# EAGLE design basic (EAGLE 8.3.2)
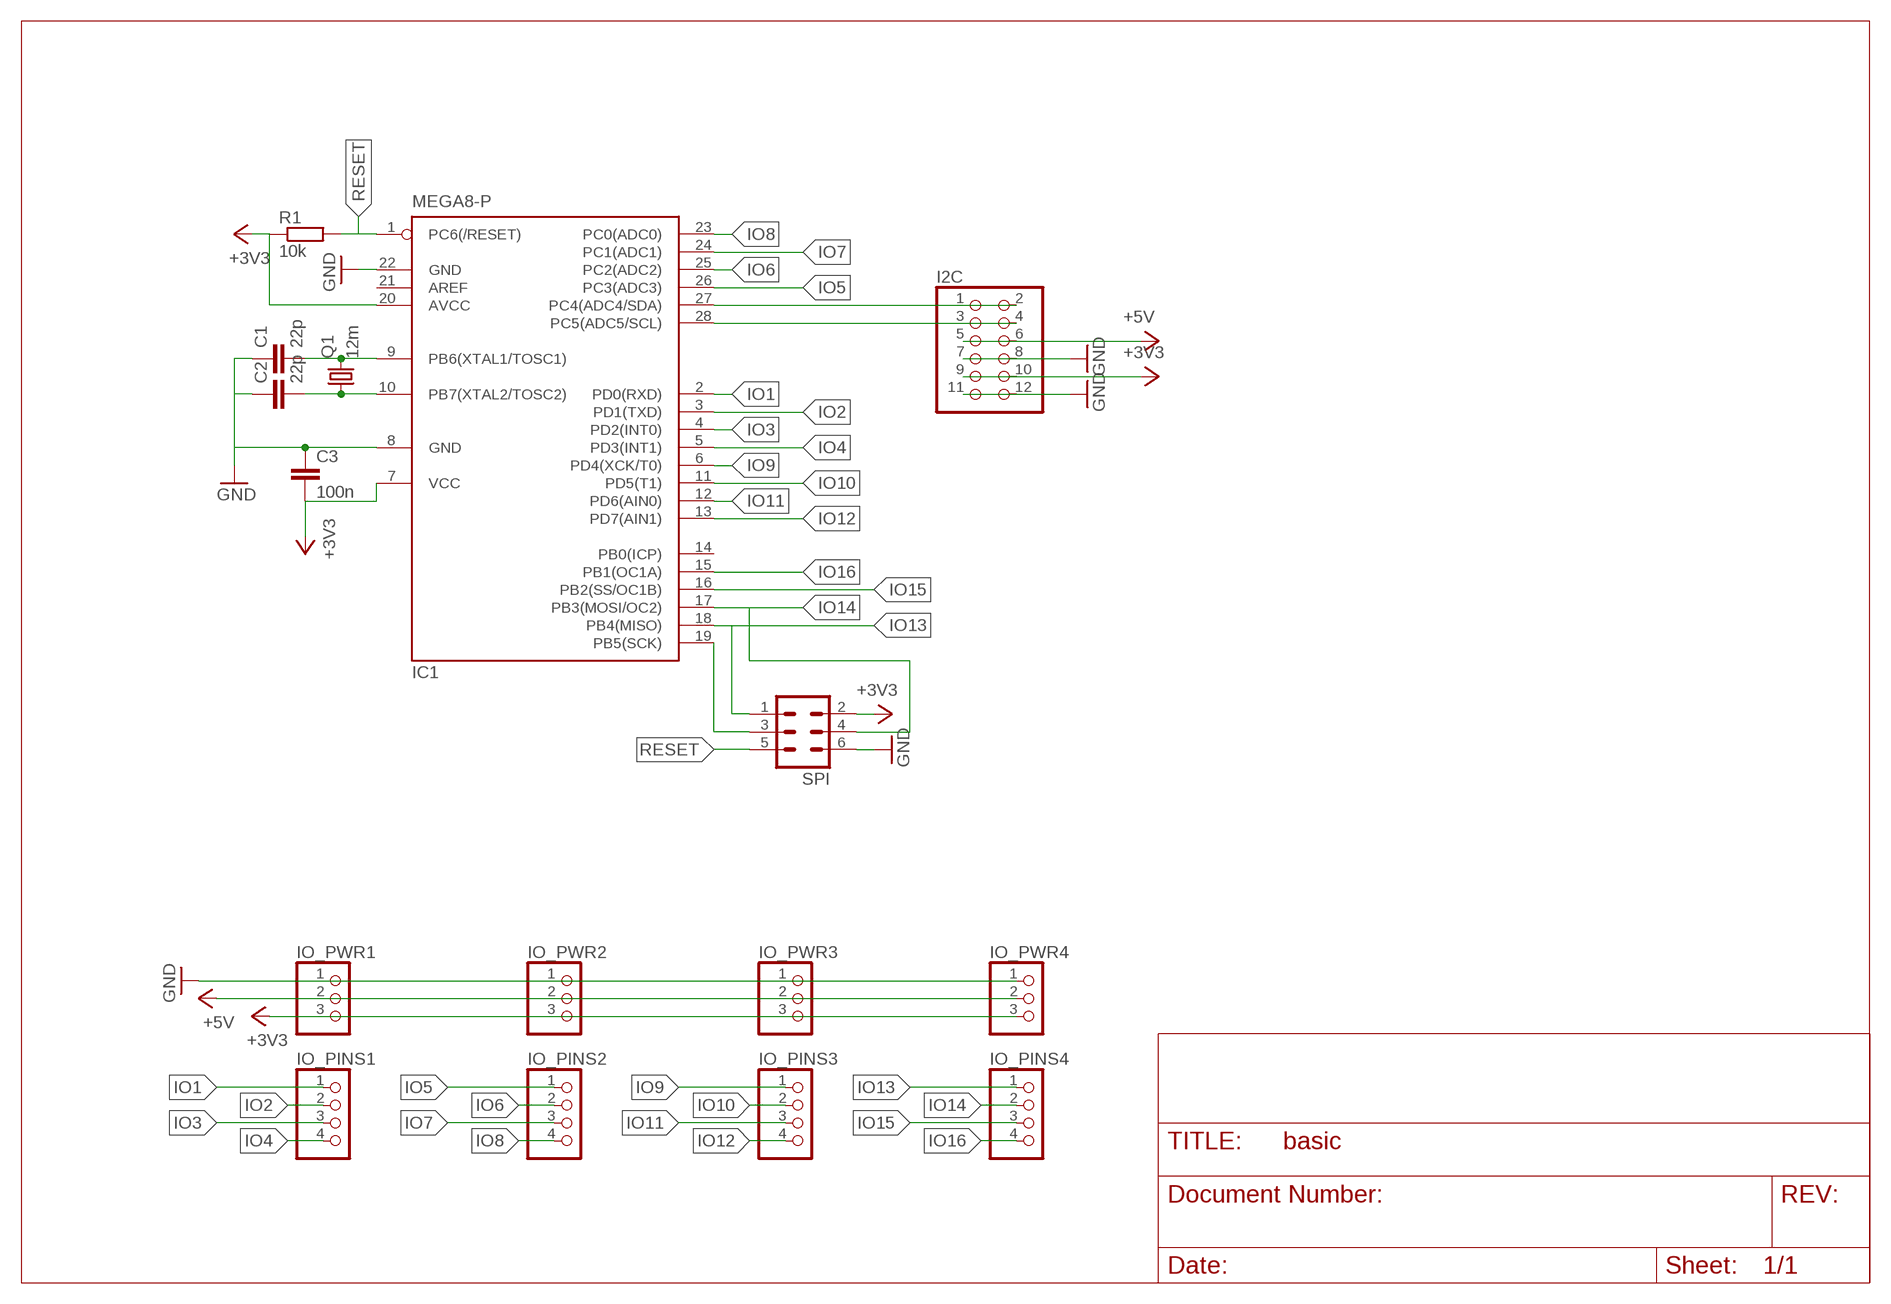
[diagram p0: schematic, sheet 1]

## Parts
C1  22p  C-EU025-025X050  [C025-025X050]
C2  22p  C-EU025-025X050  [C025-025X050]
C3  100n  C-EU025-025X050  [C025-025X050]
I2C  PINHD-2X6  [2X06]
IC1  MEGA8-P  [DIL28-3]
IO_PINS1  PINHD-1X4  [1X04]
IO_PINS2  PINHD-1X4  [1X04]
IO_PINS3  PINHD-1X4  [1X04]
IO_PINS4  PINHD-1X4  [1X04]
IO_PWR1  PINHD-1X3  [1X03]
IO_PWR2  PINHD-1X3  [1X03]
IO_PWR3  PINHD-1X3  [1X03]
IO_PWR4  PINHD-1X3  [1X03]
Q1  12m  CRYSTALHC49S  [HC49/S]
R1  10k  R-EU_0207/10  [0207/10]
SPI  ML6  [ML6]

## Nets
+3V3: C3.2 I2C.9 I2C.10 IC1.7(VCC) IC1.20(AVCC) IO_PWR1.3 IO_PWR2.3 IO_PWR3.3 IO_PWR4.3 R1.1 SPI.2
+5V: I2C.5 I2C.6 IO_PWR1.2 IO_PWR2.2 IO_PWR3.2 IO_PWR4.2
GND: C1.1 C2.1 C3.1 I2C.7 I2C.8 I2C.11 I2C.12 IC1.8(GND) IC1.22(GND) IO_PWR1.1 IO_PWR2.1 IO_PWR3.1 IO_PWR4.1 SPI.6
IO1: IC1.2(PD0(RXD)) IO_PINS1.1
IO2: IC1.3(PD1(TXD)) IO_PINS1.2
IO3: IC1.4(PD2(INT0)) IO_PINS1.3
IO4: IC1.5(PD3(INT1)) IO_PINS1.4
IO5: IC1.26(PC3(ADC3)) IO_PINS2.1
IO6: IC1.25(PC2(ADC2)) IO_PINS2.2
IO7: IC1.24(PC1(ADC1)) IO_PINS2.3
IO8: IC1.23(PC0(ADC0)) IO_PINS2.4
IO9: IC1.6(PD4(XCK/T0)) IO_PINS3.1
IO10: IC1.11(PD5(T1)) IO_PINS3.2
IO11: IC1.12(PD6(AIN0)) IO_PINS3.3
IO12: IC1.13(PD7(AIN1)) IO_PINS3.4
IO13: IC1.18(PB4(MISO)) IO_PINS4.1 SPI.1
IO14: IC1.17(PB3(MOSI/OC2)) IO_PINS4.2 SPI.4
IO15: IC1.16(PB2(SS/OC1B)) IO_PINS4.3
IO16: IC1.15(PB1(OC1A)) IO_PINS4.4
N$1: C2.2 IC1.10(PB7(XTAL2/TOSC2)) Q1.1
N$2: C1.2 IC1.9(PB6(XTAL1/TOSC1)) Q1.2
N$3: I2C.1 I2C.2 IC1.27(PC4(ADC4/SDA))
N$4: IC1.19(PB5(SCK)) SPI.3
N$5: I2C.3 I2C.4 IC1.28(PC5(ADC5/SCL))
RESET: IC1.1(PC6(/RESET)) R1.2 SPI.5
Unconnected: IC1.14(PB0(ICP)) IC1.21(AREF)

## Library data of the parts
C1-C3 = rcl:C-EU: CAPACITOR, European symbol
I2C = pinhead:PINHD-2X6: PIN HEADER
IC1 = atmel:MEGA8-P: MICROCONTROLLER 8 Kbytes FLASH, 1 kbytes SRAM, 512 bytes EEPROM, USART, 4-channel 10 bit ADC, 2-channel 8 bit ADC Pin compatible with Atmega48, ATMega88, ATMega168 Source: avr.lbr; OC_FARNELL: unknown; OC_NEWARK: unknown
IO_PINS1-IO_PINS4 = pinhead:PINHD-1X4: PIN HEADER
IO_PWR1-IO_PWR4 = pinhead:PINHD-1X3: PIN HEADER
Q1 = crystal:CRYSTAL: CRYSTAL; OC_FARNELL: 1667008; OC_NEWARK: unknown
R1 = resistor:R-EU_: RESISTOR, European symbol
SPI = con-ml:ML6: HARTING; OC_FARNELL: unknown; OC_NEWARK: unknown

## Board
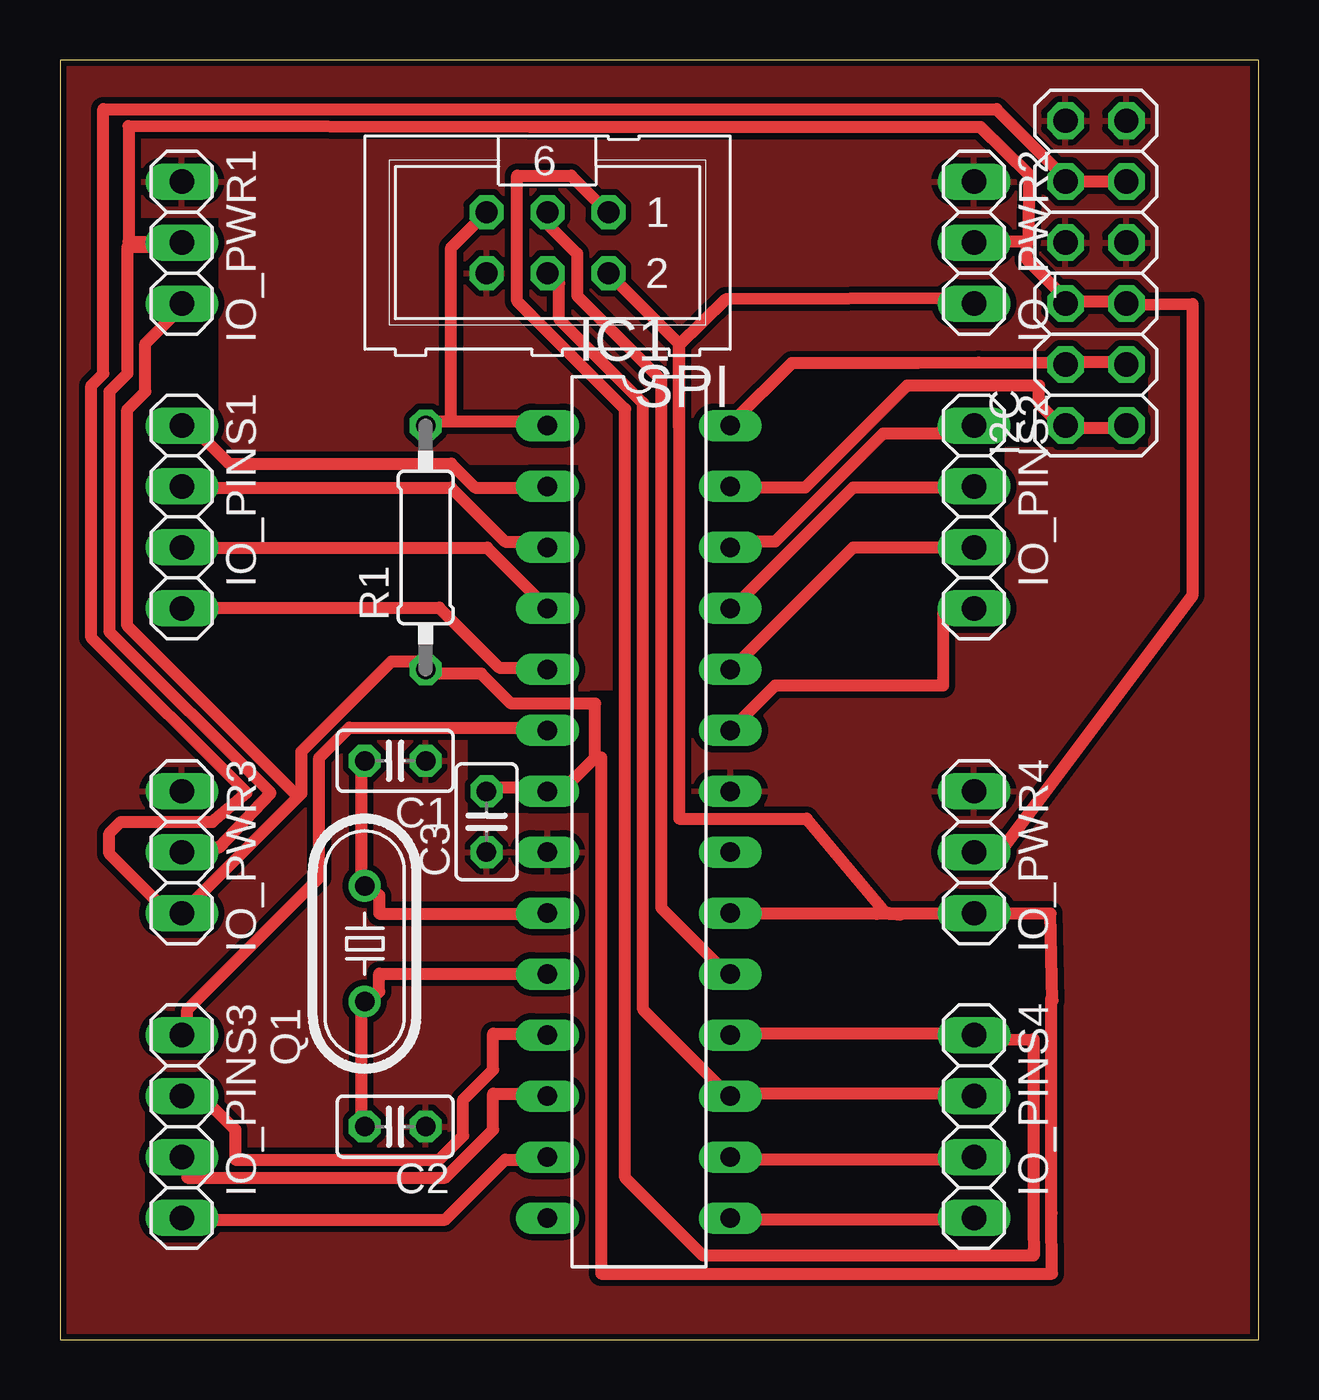
[diagram p1: board, top side]
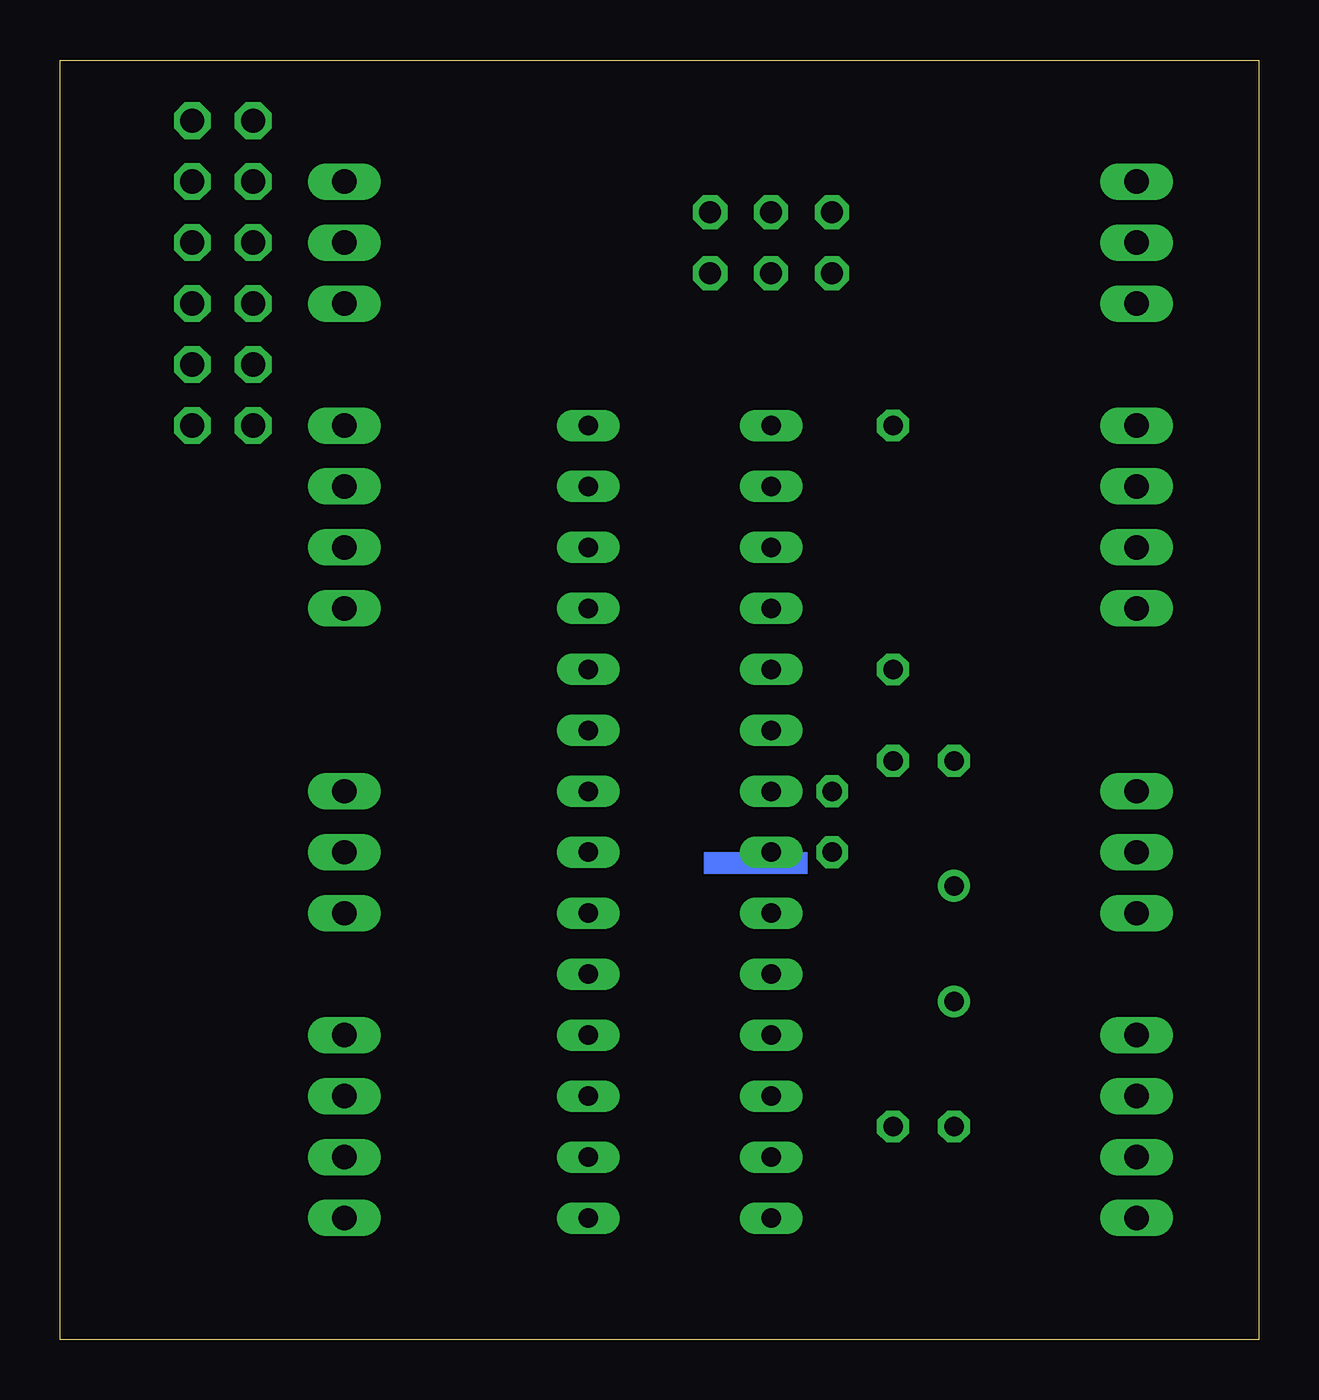
[diagram p2: board, bottom side, seen from below]

Size 49.96 x 53.33 mm. Coordinates in mm from the lower left corner, seen from the top.
Outline: 0,0 49.96,0 49.96,53.33 0,53.33 0,0
Copper layers (1*16): Top 0.035mm / dielectric 1.5mm / Bottom 0.035mm
Design rules "default *": minimum track width 20mil, minimum drill 24mil, track to track 10mil, track to pad 10mil, pad to pad 10mil, via to via 6mil, smd to smd 6mil, copper to edge 10mil, drill to drill 6mil, minimum pad ring 10mil, minimum via ring 8mil, stop-mask expansion 4mil, vias tented up to drill 0mil, thermal gap 10mil
tRestrict: area 26.3,25.8 to 28.7,27.8; area 3.8,18.4 to 5.8,20.3; area 2.2,19.7 to 3.9,21.5; area 26.3,25.5 to 26.5,25.9; area 26.3,22.2 to 26.8,22.7; area 3.2,19.2 to 3.9,19.8; area 6.5,22.6 to 7,23.1; area 3,38.4 to 3.7,38.7; area 18,26.9 to 19.7,27.9; area 21.5,25.5 to 22,26.2; area 17.1,8.6 to 17.7,10; area 3.9,5 to 16.1,6.9; 26 more areas

### Footprints (pad centres in the part's own frame; a part is rotated, then mirrored left to right if it is on the bottom)
C025-025X050 = drill 0.813 octagon: 1 -1.27,0; 2 1.27,0
2X06 = drill 1.016 octagon: 1 -6.35,-1.27; 2 -6.35,1.27; 3 -3.81,-1.27; 4 -3.81,1.27; 5 -1.27,-1.27; 6 -1.27,1.27; 7 1.27,-1.27; 8 1.27,1.27; 9 3.81,-1.27; 10 3.81,1.27; 11 6.35,-1.27; 12 6.35,1.27
DIL28-3 = drill 0.813 long: 1 -16.51,-3.81; 2 -13.97,-3.81; 3 -11.43,-3.81; 4 -8.89,-3.81; 5 -6.35,-3.81; 6 -3.81,-3.81; 7 -1.27,-3.81; 8 1.27,-3.81; 9 3.81,-3.81; 10 6.35,-3.81; 11 8.89,-3.81; 12 11.43,-3.81; 13 13.97,-3.81; 14 16.51,-3.81; 15 16.51,3.81; 16 13.97,3.81; 17 11.43,3.81; 18 8.89,3.81; 19 6.35,3.81; 20 3.81,3.81; 21 1.27,3.81; 22 -1.27,3.81; 23 -3.81,3.81; 24 -6.35,3.81; 25 -8.89,3.81; 26 -11.43,3.81; 27 -13.97,3.81; 28 -16.51,3.81
1X04 = drill 1.016 long: 1 -3.81,0; 2 -1.27,0; 3 1.27,0; 4 3.81,0
1X03 = drill 1.016 long: 1 -2.54,0; 2 0,0; 3 2.54,0
HC49/S = drill 0.813: 1 -2.413,0; 2 2.413,0
0207/10 = drill 0.813 octagon: 1 -5.08,0; 2 5.08,0
ML6 = drill 0.914 octagon: 1 -2.54,-1.27; 2 -2.54,1.27; 3 0,-1.27; 4 0,1.27; 5 2.54,-1.27; 6 2.54,1.27

### Placement (x,y rotation side)
C1  13.97,24.13 180 top
C2  13.97,8.89 180 top
C3  17.78,21.59 90 top
I2C  43.18,44.45 90 top
IC1  24.13,21.59 270 top
IO_PINS1  5.08,34.29 270 top
IO_PINS2  38.1,34.29 270 top
IO_PINS3  5.08,8.89 270 top
IO_PINS4  38.1,8.89 270 top
IO_PWR1  5.08,45.72 270 top
IO_PWR2  38.1,45.72 270 top
IO_PWR3  5.08,20.32 270 top
IO_PWR4  38.1,20.32 270 top
Q1  12.7,16.51 90 top
R1  15.24,33.02 90 top
SPI  20.32,45.72 180 top

### Tracks (layer width: path | path; a pad name or v marks a point on that pad's centre or on a via)
+3V3
  Top 0.508: 25.81,38.01 25.81,41.51 23.06,44.26 SPI.2 | 25.81,38.01 25.79,41.45 27.75,43.36 38.08,43.4 37.45,42.88 IO_PWR2.3 | 25.81,38.01 25.81,21.72 31.11,21.72 34.4,17.8 IO_PWR4.3 34.05,17.76 35.04,17.73 34.56,17.78 | I2C.9 I2C.10 41.81,48.51 39.04,51.28 1.81,51.28 1.81,40.26 1.31,39.76 1.31,29.26 7.78,22.79 6.35,21.59 2.54,21.59 2.06,21.11 2.06,20.26 4.31,18.01 5.06,18.01 IO_PWR3.3 9.93,22.63 | 22.31,24.26 22.31,26.51 18.81,26.51 17.56,27.76 15.31,27.76 R1.1 15.06,28.01 15.06,28.26 13.81,28.26 10.06,24.51 10.06,22.76 9.93,22.63 | 22.31,24.26 21.06,23.01 20.56,23.01 IC1.7 20.31,23.01 17.81,23.01 C3.2 | 9.93,22.63 2.81,29.76 2.81,38.76 3.56,39.51 3.56,41.51 5.06,43.01 IO_PWR1.3 | 34.56,17.78 41.29,17.77 41.37,14.13 41.33,14.26 41.33,5.28 41.35,2.76 22.56,2.76 22.56,24.26 22.31,24.26 | IC1.20 34.56,17.78
+5V
  Top 0.508: IO_PWR3.2 5.06,20.51 6.62,20.51 8.78,22.79 2.06,29.51 2.06,39.51 2.81,40.26 2.81,45.54 4.56,45.51 5.06,45.51 IO_PWR1.2 5.31,45.76 2.86,45.76 2.86,50.57 19.58,50.53 38.37,50.53 40.4,48.53 40.38,45.76 40.31,45.76 | IO_PWR4.2 39.22,20.38 47.2,31.03 47.2,43.16 44.43,43.14 44.56,43.01 I2C.5 44.31,43.26 42.06,43.26 I2C.6 41.81,43.26 41.81,43.51 40.31,45.01 40.31,45.76 | 40.31,45.76 38.08,45.76 | 38.08,45.76 37.06,45.76 IO_PWR2.2 38.08,45.76
GND
  pour Top: -1.27,54.61 49.53,54.61 49.53,-1.27 -1.27,-1.27
IO1
  Top 0.508: IC1.2 20.31,35.51 17.31,35.51 16.31,36.51 7.06,36.51 5.31,38.26 IO_PINS1.1
IO2
  Top 0.508: IC1.3 20.31,33.26 18.56,33.26 16.31,35.51 5.31,35.51 IO_PINS1.2
IO3
  Top 0.508: IC1.4 20.31,30.51 17.81,33.01 5.31,33.01 IO_PINS1.3
IO4
  Top 0.508: IC1.5 20.31,28.01 18.31,28.01 15.81,30.51 5.31,30.51 IO_PINS1.4
IO5
  Top 0.508: IC1.26 28.06,33.26 29.81,33.26 34.31,37.76 36.81,37.76 36.81,38.01 IO_PINS2.1
IO6
  Top 0.508: IC1.25 28.06,30.51 33.06,35.51 36.81,35.51 IO_PINS2.2
IO7
  Top 0.508: IC1.24 28.06,28.01 33.06,33.01 36.81,33.01 IO_PINS2.3
IO8
  Top 0.508: IC1.23 28.06,25.51 29.81,27.26 36.81,27.26 36.81,30.26 IO_PINS2.4
IO9
  Top 0.508: IC1.6 20.31,25.51 12.06,25.51 10.81,24.26 10.81,19.26 5.31,13.76 5.31,12.76 IO_PINS3.1
IO10
  Top 0.508: IC1.11 20.31,12.76 18.06,12.76 18.06,11.26 16.81,10.01 16.81,8.51 15.81,7.51 7.31,7.51 7.31,8.76 6.06,10.01 5.31,10.01 IO_PINS3.2
IO11
  Top 0.508: IC1.12 20.31,10.26 18.06,10.26 18.06,8.76 16.06,6.76 5.31,6.76 5.31,7.51 IO_PINS3.3
IO12
  Top 0.508: IC1.13 20.31,7.51 18.56,7.51 16.06,5.01 5.31,5.01 IO_PINS3.4
IO13
  Top 0.508: IC1.18 28.06,12.76 36.81,12.76 IO_PINS4.1 37.06,12.51 37.56,12.51 40.58,12.54 40.58,4.51 40.59,3.76 40.59,3.51 26.81,3.51 23.56,6.76 23.56,38.78 19.06,43.28 19.06,48.51 21.31,48.51 22.81,47.01 SPI.1
IO14
  Top 0.508: IO_PINS4.2 36.81,10.26 28.06,10.26 IC1.17 27.81,10.26 24.31,13.76 24.31,39.03 20.81,42.53 20.81,44.01 20.56,44.26 SPI.4
IO15
  Top 0.508: IC1.16 28.06,7.51 36.81,7.51 IO_PINS4.3
IO16
  Top 0.508: IC1.15 28.06,5.01 36.81,5.01 IO_PINS4.4
N$1
  Top 0.508: C2.2 12.56,9.01 12.56,14.01 Q1.1 12.81,14.01 13.31,14.51 13.31,15.26 20.31,15.26 IC1.10
N$2
  Top 0.508: C1.2 12.56,24.01 12.56,19.01 Q1.2 12.81,19.01 13.31,18.51 13.31,17.76 20.31,17.76 IC1.9
N$3
  Top 0.508: IC1.27 28.06,35.51 31.06,35.51 35.31,39.76 40.81,39.76 40.81,39.01 41.81,38.01 I2C.2 42.06,38.01 44.31,38.01 I2C.1
N$4
  Top 0.508: IC1.19 27.81,15.26 25.06,18.01 25.06,40.01 21.56,43.51 21.56,45.26 20.31,46.51 20.31,46.76 SPI.3
N$5
  Top 0.508: IC1.28 28.06,38.26 30.5,40.7 35.75,40.7 38.29,40.72 42.1,40.7 42.16,40.77 41.81,41.01 41.81,40.76 I2C.4 42.06,40.76 44.31,40.76 I2C.3
N$6
  pour Top: 0,53.34 49.53,53.34 49.53,0 0,0
RESET
  Top 0.508: 16.31,38.26 20.31,38.26 IC1.1 | 16.31,38.26 15.31,38.26 R1.2 | 16.31,38.26 16.31,45.51 17.56,46.76 SPI.5
(copper drawn outside any net)
  shapes: Bottom area x1